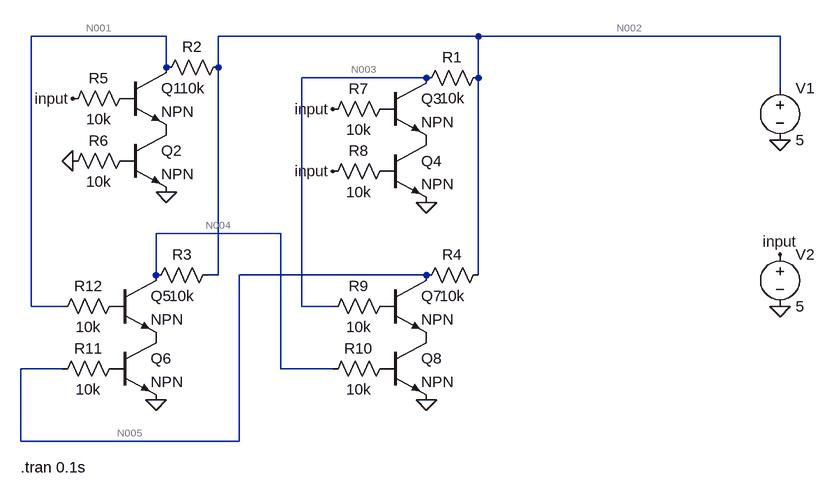
[diagram p0: schematic SRSpice.asc]
SRSpice.asc, the LTspice schematic file:
Version 4
SHEET 1 1156 744
WIRE 112 64 -96 64
WIRE 592 64 192 64
WIRE 1056 64 592 64
WIRE 112 112 112 64
WIRE 192 112 192 64
WIRE 512 128 320 128
WIRE 592 128 592 64
WIRE 1056 144 1056 64
WIRE 288 368 96 368
WIRE 96 432 96 368
WIRE 192 432 192 112
WIRE 192 432 176 432
WIRE 512 432 224 432
WIRE 592 432 592 128
WIRE -96 480 -96 64
WIRE -48 480 -96 480
WIRE 320 480 320 128
WIRE 368 480 320 480
WIRE -48 576 -112 576
WIRE 288 576 288 368
WIRE 368 576 288 576
WIRE -112 688 -112 576
WIRE 224 688 224 432
WIRE 224 688 -112 688
FLAG 112 304 0
FLAG 512 320 0
FLAG 512 624 0
FLAG 96 624 0
FLAG 1056 224 0
FLAG 1056 480 0
FLAG -32 256 0
FLAG 1056 400 input
FLAG 368 272 input
FLAG 368 176 input
FLAG -32 160 input
SYMBOL npn 48 112 R0
SYMATTR InstName Q1
SYMBOL npn 48 208 R0
SYMATTR InstName Q2
SYMBOL npn 448 128 R0
SYMATTR InstName Q3
SYMBOL npn 448 224 R0
SYMATTR InstName Q4
SYMBOL npn 32 432 R0
SYMATTR InstName Q5
SYMBOL npn 32 528 R0
SYMATTR InstName Q6
SYMBOL npn 448 432 R0
SYMATTR InstName Q7
SYMBOL npn 448 528 R0
SYMATTR InstName Q8
SYMBOL voltage 1056 128 R0
WINDOW 123 0 0 Left 0
WINDOW 39 0 0 Left 0
SYMATTR InstName V1
SYMATTR Value 5
SYMBOL res 608 112 R90
WINDOW 0 0 56 VBottom 2
WINDOW 3 32 56 VTop 2
SYMATTR InstName R1
SYMATTR Value 10k
SYMBOL res 208 96 R90
WINDOW 0 0 56 VBottom 2
WINDOW 3 32 56 VTop 2
SYMATTR InstName R2
SYMATTR Value 10k
SYMBOL res 192 416 R90
WINDOW 0 0 56 VBottom 2
WINDOW 3 32 56 VTop 2
SYMATTR InstName R3
SYMATTR Value 10k
SYMBOL res 608 416 R90
WINDOW 0 0 56 VBottom 2
WINDOW 3 32 56 VTop 2
SYMATTR InstName R4
SYMATTR Value 10k
SYMBOL res 64 144 R90
WINDOW 0 0 56 VBottom 2
WINDOW 3 32 56 VTop 2
SYMATTR InstName R5
SYMATTR Value 10k
SYMBOL res 64 240 R90
WINDOW 0 0 56 VBottom 2
WINDOW 3 32 56 VTop 2
SYMATTR InstName R6
SYMATTR Value 10k
SYMBOL res 464 160 R90
WINDOW 0 0 56 VBottom 2
WINDOW 3 32 56 VTop 2
SYMATTR InstName R7
SYMATTR Value 10k
SYMBOL res 464 256 R90
WINDOW 0 0 56 VBottom 2
WINDOW 3 32 56 VTop 2
SYMATTR InstName R8
SYMATTR Value 10k
SYMBOL res 464 464 R90
WINDOW 0 0 56 VBottom 2
WINDOW 3 32 56 VTop 2
SYMATTR InstName R9
SYMATTR Value 10k
SYMBOL res 464 560 R90
WINDOW 0 0 56 VBottom 2
WINDOW 3 32 56 VTop 2
SYMATTR InstName R10
SYMATTR Value 10k
SYMBOL res 48 560 R90
WINDOW 0 0 56 VBottom 2
WINDOW 3 32 56 VTop 2
SYMATTR InstName R11
SYMATTR Value 10k
SYMBOL res 48 464 R90
WINDOW 0 0 56 VBottom 2
WINDOW 3 32 56 VTop 2
SYMATTR InstName R12
SYMATTR Value 10k
SYMBOL voltage 1056 384 R0
WINDOW 123 0 0 Left 0
WINDOW 39 0 0 Left 0
SYMATTR InstName V2
SYMATTR Value 5
TEXT -112 728 Left 2 !.tran 0.1s

The netlist it stands for:
* SRSpice.asc
Q1 N001 P001 P002 0 NPN
Q2 P002 P003 0 0 NPN
Q3 N003 P004 P005 0 NPN
Q4 P005 P006 0 0 NPN
Q5 N004 P007 P008 0 NPN
Q6 P008 P009 0 0 NPN
Q7 N005 P010 P011 0 NPN
Q8 P011 P012 0 0 NPN
V1 N002 0 5
R1 N002 N003 10k
R2 N002 N001 10k
R3 N002 N004 10k
R4 N002 N005 10k
R5 P001 input 10k
R6 P003 0 10k
R7 P004 input 10k
R8 P006 input 10k
R9 P010 N003 10k
R10 P012 N004 10k
R11 P009 N005 10k
R12 P007 N001 10k
V2 input 0 5
.model NPN NPN
.model PNP PNP
.lib standard.bjt
.tran 0.1s
.backanno
.end

* Results of the author's LTspice run, read from the files saved beside the schematic
* Operating Point, zero values left out:
*   V(n001) = 3.369 V
*   V(p001) = 4.081 V
*   V(p002) = 3.369 V
*   V(p003) = 33.69 nV
*   V(n003) = 67.69 mV
*   V(p004) = 818.5 mV
*   V(p005) = 37.46 mV
*   V(p006) = 788.2 mV
*   V(n004) = 81.1 mV
*   V(p007) = 819 mV
*   V(p008) = 45.2 mV
*   V(p009) = 777.8 mV
*   V(n005) = 2.889 V
*   V(p010) = 67.69 mV
*   V(p011) = 73.37 mV
*   V(p012) = 81.1 mV
*   V(n002) = 5 V
*   V(input) = 5 V
*   Ic(Q7) = 2.821 pA
*   Ib(Q7) = -2.827 pA
*   Ic(Q6) = 746.9 µA
*   Ib(Q6) = 211.1 µA
*   Ie(Q6) = -958 µA
*   Ic(Q5) = 491.9 µA
*   Ib(Q5) = 255 µA
*   Ie(Q5) = -746.9 µA
*   Ic(Q4) = 911.4 µA
*   Ib(Q4) = 421.2 µA
*   Ie(Q4) = -1.333 mA
*   Ic(Q3) = 493.2 µA
*   Ib(Q3) = 418.1 µA
*   Ie(Q3) = -911.4 µA
*   Ic(Q2) = 3.369 pA
*   Ib(Q2) = -3.369 pA
*   Ic(Q1) = -91.89 µA
*   Ib(Q1) = 91.89 µA
*   Ie(Q1) = -2.952 pA
*   I(R12) = -255 µA
*   I(R11) = -211.1 µA
*   I(R9) = 2.827 pA
*   I(R8) = -421.2 µA
*   I(R7) = -418.1 µA
*   I(R6) = 3.369 pA
*   I(R5) = -91.89 µA
*   I(R4) = 211.1 µA
*   I(R3) = 491.9 µA
*   I(R2) = 163.1 µA
*   I(R1) = 493.2 µA
*   I(V2) = -931.2 µA
*   I(V1) = -1.359 mA